# EAGLE design voltage_meas (EAGLE 6.4)
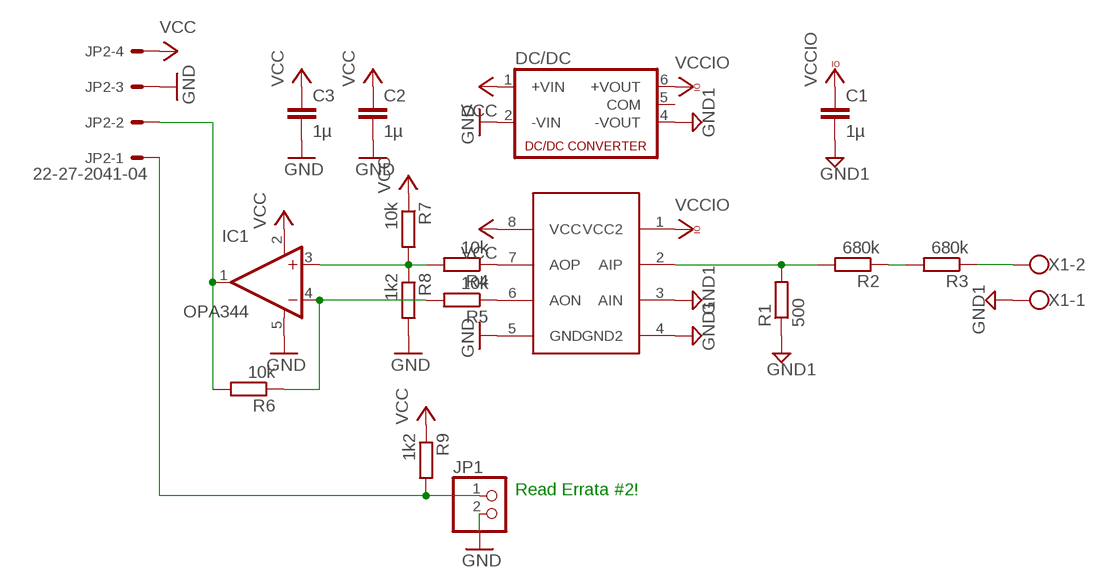
[diagram p0: schematic, sheet 1]

## Parts
C1  1µ  C-EU025-024X044  [C025-024X044]
C2  1µ  C-EU025-024X044  [C025-024X044]
C3  1µ  C-EU025-024X044  [C025-024X044]
DC/DC  MEV3  [NMA]
IC1  OPA344  [SOT23-5]
IC2  SI8920  [DIP8]
JP1  PINHD-1X2  [1X02]
JP2  22-27-2041-04  [6410-04]
R1  500  R-EU_0207/10  [0207/10]
R2  680k  R-EU_0207/10  [0207/10]
R3  680k  R-EU_0207/10  [0207/10]
R4  10k  R-EU_0207/10  [0207/10]
R5  10k  R-EU_0207/10  [0207/10]
R6  10k  R-EU_0207/10  [0207/10]
R7  10k  R-EU_0207/10  [0207/10]
R8  1k2  R-EU_0207/10  [0207/10]
R9  1k2  R-EU_0207/10  [0207/10]
X1  W237-102  [W237-102]

## Nets
GND: C2.2 C3.2 DC/DC.2(-VIN) IC1.5(V+) IC2.5(GND) JP1.2 JP2.3 R8.2
GND1: C1.2 DC/DC.4(-VOUT) IC2.3(AIN) IC2.4(GND2) R1.1 X1.1
N$1: IC2.2(AIP) R1.2 R2.2
N$2: R2.1 R3.2
N$3: R3.1 X1.2
N$4: IC2.7(AOP) R4.1
N$5: IC2.6(AON) R5.1
N$6: IC1.1(OUT) JP2.2 R6.2
N$7: IC1.4(-IN) R5.2 R6.1
N$8: IC1.3(+IN) R4.2 R7.2 R8.1
N$9: JP1.1 JP2.1 R9.2
VCC: C2.1 C3.1 DC/DC.1(+VIN) IC1.2(V-) IC2.8(VCC) JP2.4 R7.1 R9.1
VCCIO: C1.1 DC/DC.6(+VOUT) IC2.1(VCC2)
Unconnected: DC/DC.5(COM)

## Notes on the sheet
- Read Errata #2!

## Library data of the parts
C1-C3 = rcl:C-EU: CAPACITOR, European symbol
DC/DC = dc-dc-converter:MEV3: DC-DC CONVERTER
IC1 = SparkFun-AnalogIC:OPA344: Single gate rail-to-rail output op-amp. Inputs extend 300mV past rails.
IC2 = silabs:SI8920
JP1 = pinhead:PINHD-1X2: PIN HEADER
JP2 = con-molex:22-?-04: CONNECTOR wire to board 2.54 mm (.1 inch) pitch header; OC_FARNELL: unknown; OC_NEWARK: unknown
R1-R9 = rcl:R-EU_: RESISTOR, European symbol
X1 = con-wago-500:W237-102: WAGO SCREW CLAMP; MPN: 237-102; OC_FARNELL: unknown; OC_NEWARK: 70K9898

## Board
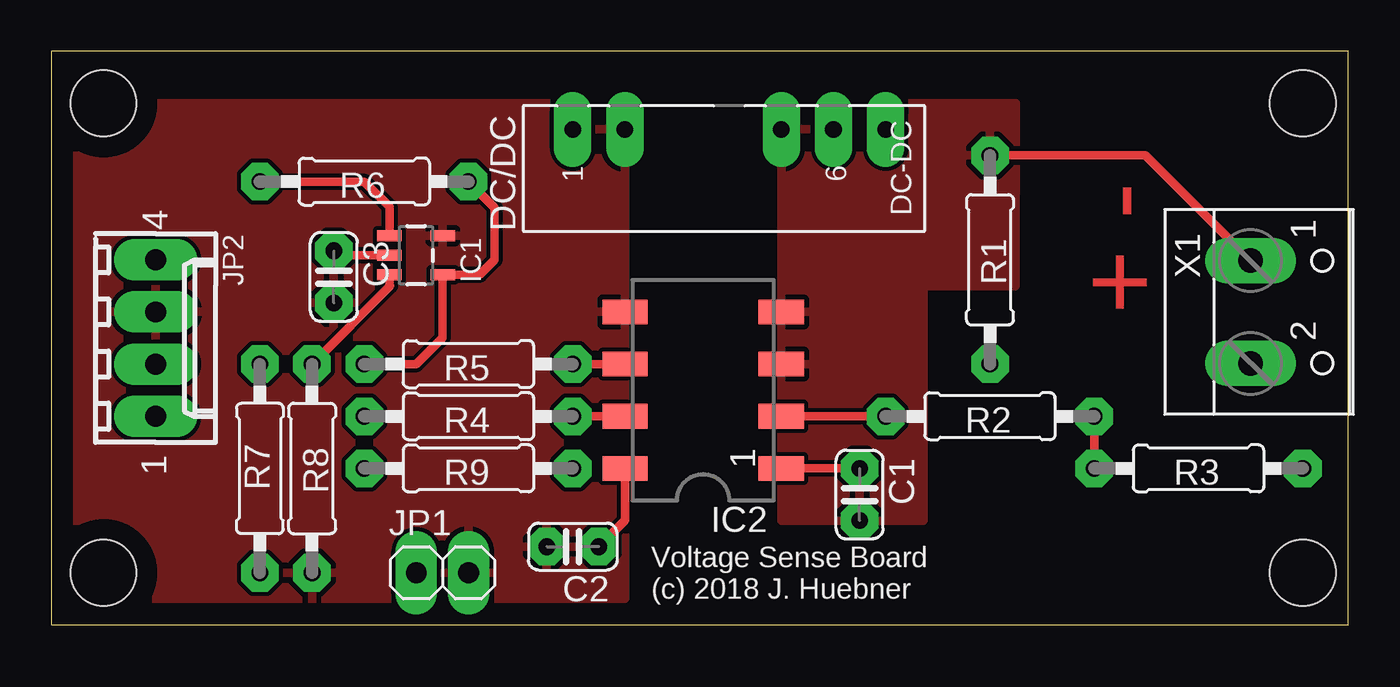
[diagram p1: board, top side]
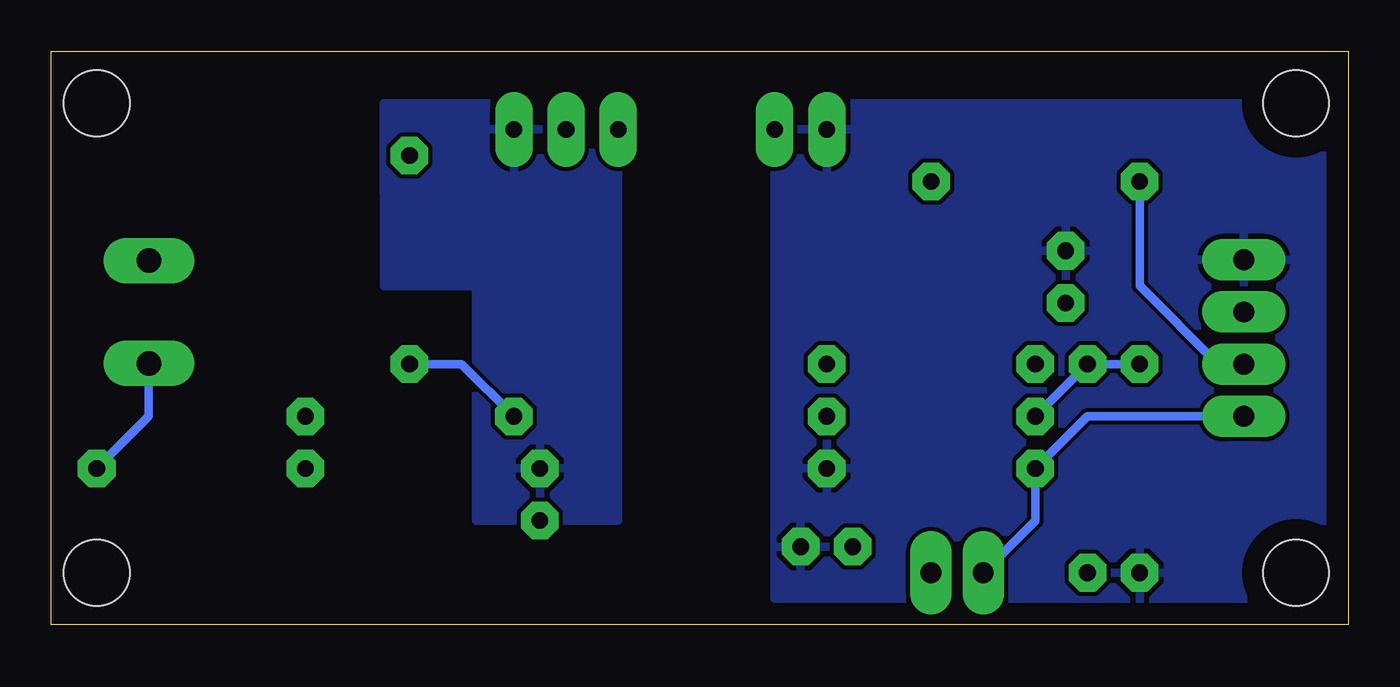
[diagram p2: board, bottom side, seen from below]

Size 63.17 x 27.93 mm. Coordinates in mm from the lower left corner, seen from the top.
Outline: 0,0 63.17,0 63.17,27.93 0,27.93 0,0
Copper layers (1*16): Top 0.035mm / dielectric 1.5mm / Bottom 0.035mm
Design rules "default *": minimum track width 10mil, minimum drill 24mil, track to track 8mil, track to pad 8mil, pad to pad 8mil, via to via 8mil, smd to smd 8mil, copper to edge 40mil, drill to drill 8mil, minimum pad ring 20mil, minimum via ring 8mil, stop-mask expansion 4mil, vias tented up to drill 0mil, thermal gap 10mil
Holes 3.2 mm at 2.54,2.54 60.96,25.4 60.96,2.54 2.54,25.4

### Footprints (pad centres in the part's own frame; a part is rotated, then mirrored left to right if it is on the bottom)
C025-024X044 = drill 0.813 octagon: 1 -1.27,0; 2 1.27,0
NMA = drill 0.813 long: 1 0,6.35; 2 0,3.81; 4 0,-3.81; 5 0,-6.35; 6 0,-8.89
SOT23-5 = smd 0.55 x 1.2: 1 -0.95,-1.3; 2 0,-1.3; 3 0.95,-1.3; 4 0.95,1.3; 5 -0.95,1.3
DIP8 = smd 1.2 x 2.2: 1 -3.81,-3.8; 2 -1.27,-3.8; 3 1.27,-3.8; 4 3.81,-3.8; 5 3.81,3.8; 6 1.27,3.8; 7 -1.27,3.8; 8 -3.81,3.8
1X02 = drill 1.016 long: 1 -1.27,0; 2 1.27,0
6410-04 = drill 1.016 long: 1 3.81,0; 2 1.27,0; 3 -1.27,0; 4 -3.81,0
0207/10 = drill 0.813 octagon: 1 -5.08,0; 2 5.08,0
W237-102 = drill 1.194 long: 1 -2.5,-1.27; 2 2.5,-1.27

### Placement (x,y rotation side)
C1  39.37,6.35 270 top
C2  25.4,3.81 180 top
C3  13.76,16.95 270 top
DC/DC  31.75,24.13 90 top
IC1  17.77,18 270 top
IC2  31.75,11.43 90 top
JP1  19.05,2.54 0 top
JP2  5.08,13.97 270 top
R1  45.72,17.78 270 top
R2  45.72,10.16 180 top
R3  55.88,7.62 180 top
R4  20.32,10.16 180 top
R5  20.32,12.7 180 top
R6  15.24,21.59 180 top
R7  10.16,7.62 90 top
R8  12.7,7.62 270 top
R9  20.32,7.62 180 top
X1  59.69,15.24 270 top

### Tracks (layer width: path | path; a pad name or v marks a point on that pad's centre or on a via)
GND
  pour Top: 27.94,25.4 1.27,25.4 1.27,1.27 27.94,1.27
GND1
  Top 0.406: X1.1 53.3,22.86 R1.1
  pour Top: 35.56,25.4 46.99,25.4 46.96,16.5 42.49,16.5 42.49,5.08 35.56,5.08
N$1
  Top 0.406: IC2.2 R2.2
  Bottom 0.406: R2.2 43.18,12.7 R1.2
N$2
  Top 0.406: R2.1 R3.2
N$3
  Bottom 0.406: R3.1 58.42,10.16 X1.2
N$4
  Top 0.406: R4.1 IC2.7
N$5
  Top 0.406: R5.1 IC2.6
N$6
  Top 0.406: R6.2 15.24,21.59 16.47,20.36 IC1.1
  Bottom 0.406: R6.2 10.16,16.51 6.35,12.7 JP2.2
N$7
  Top 0.406: R5.2 17.78,12.7 19.07,13.99 IC1.4 20.86,17.05 21.59,17.78 21.59,20.32 R6.1
N$8
  Top 0.406: 12.66,12.7 R8.1 16.51,16.51 16.47,16.55 IC1.3
  Bottom 0.406: R7.2 R8.1 R4.2
N$9
  Bottom 0.406: JP1.1 15.24,5.08 R9.2 12.7,10.16 JP2.1
VCC
  Top 0.406: C2.1 27.95,5.09 IC2.8 | C3.1 13.98,18 IC1.2
  pour Bottom: 1.27,1.27 27.94,1.27 27.94,25.4 1.27,25.4
VCCIO
  Top 0.406: C1.1 IC2.1
  pour Bottom: 35.56,5.08 42.49,5.08 42.49,16.5 46.96,16.5 46.99,25.4 35.56,25.4

### Text on the board
Top: + -
tNames: Voltage Sense Board / (c) 2018 J. Huebner